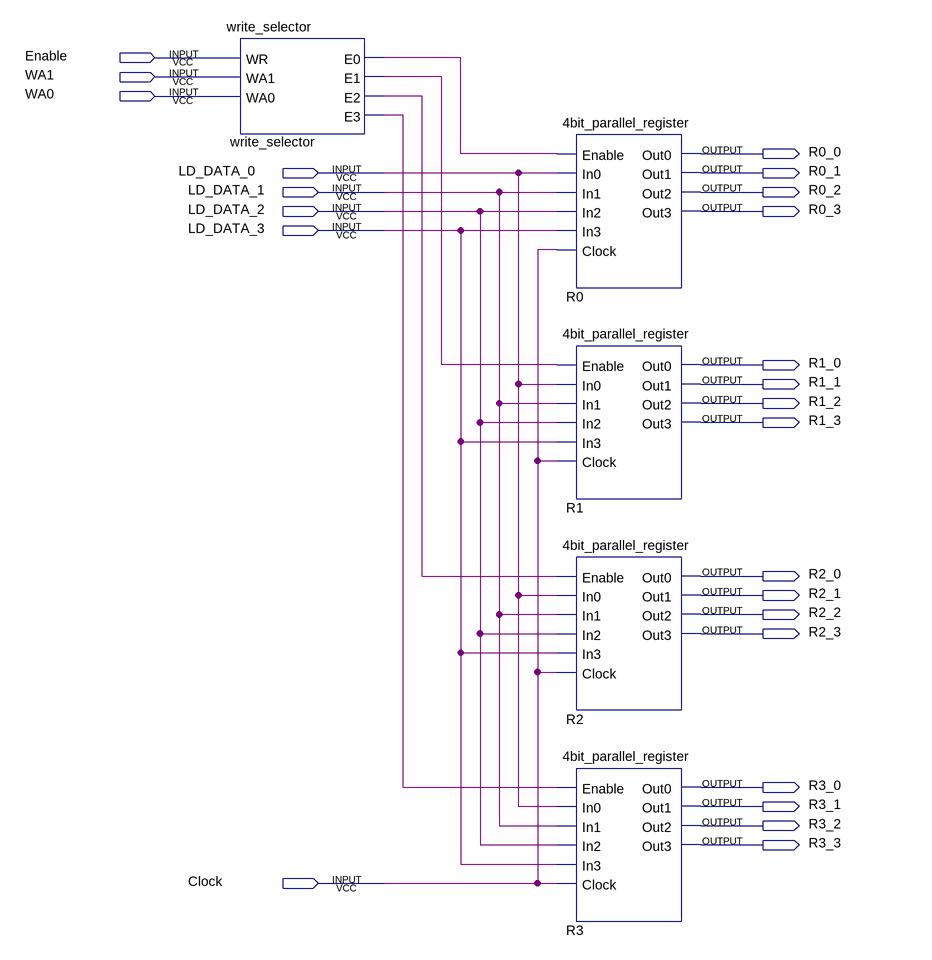
[diagram p0: schematic sheet]
// Quartus schematic 4bit_4reg_file.bdf as structural Verilog: 5 symbols, 24 pins
module \4bit_4reg_file  (
  input  Enable,
  input  WA1,
  input  WA0,
  input  LD_DATA_0,
  input  LD_DATA_1,
  input  LD_DATA_2,
  input  LD_DATA_3,
  input  Clock,
  output R0_0,
  output R0_1,
  output R0_2,
  output R0_3,
  output R1_0,
  output R1_1,
  output R1_2,
  output R1_3,
  output R2_0,
  output R2_1,
  output R2_2,
  output R2_3,
  output R3_0,
  output R3_1,
  output R3_2,
  output R3_3
);

  wire write_selector_e0, write_selector_e1, write_selector_e2, write_selector_e3;

  write_selector write_selector (
    .WR(Enable), .WA1(WA1), .WA0(WA0), .E0(write_selector_e0), .E1(write_selector_e1),
    .E2(write_selector_e2), .E3(write_selector_e3));
  \4bit_parallel_register  R0 (
    .Enable(write_selector_e0), .In0(LD_DATA_0), .In1(LD_DATA_1), .In2(LD_DATA_2), .In3(LD_DATA_3),
    .Clock(Clock), .Out0(R0_0), .Out1(R0_1), .Out2(R0_2), .Out3(R0_3));
  \4bit_parallel_register  R1 (
    .Enable(write_selector_e1), .In0(LD_DATA_0), .In1(LD_DATA_1), .In2(LD_DATA_2), .In3(LD_DATA_3),
    .Clock(Clock), .Out0(R1_0), .Out1(R1_1), .Out2(R1_2), .Out3(R1_3));
  \4bit_parallel_register  R2 (
    .Enable(write_selector_e2), .In0(LD_DATA_0), .In1(LD_DATA_1), .In2(LD_DATA_2), .In3(LD_DATA_3),
    .Clock(Clock), .Out0(R2_0), .Out1(R2_1), .Out2(R2_2), .Out3(R2_3));
  \4bit_parallel_register  R3 (
    .Enable(write_selector_e3), .In0(LD_DATA_0), .In1(LD_DATA_1), .In2(LD_DATA_2), .In3(LD_DATA_3),
    .Clock(Clock), .Out0(R3_0), .Out1(R3_1), .Out2(R3_2), .Out3(R3_3));
endmodule
